# EAGLE design Remote (EAGLE 7.3.0)
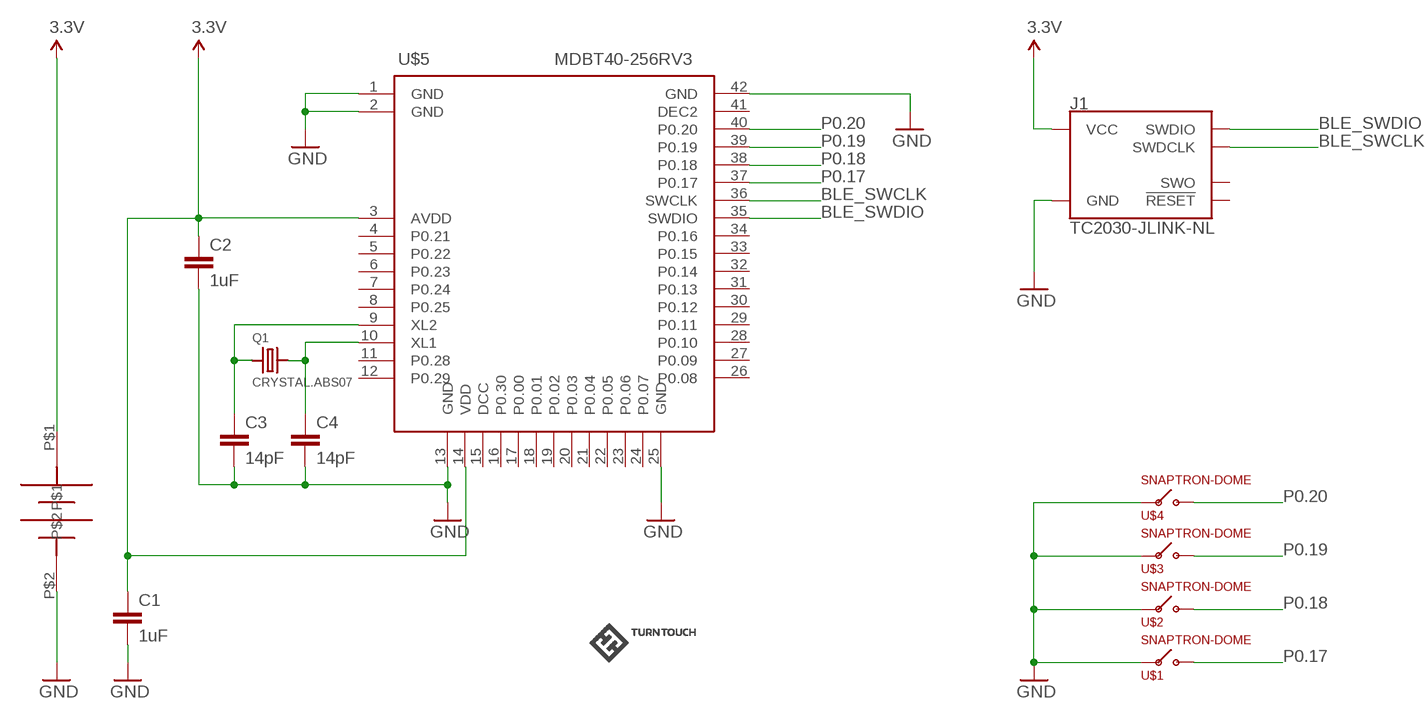
[diagram p0: schematic, sheet 1]

## Parts
C1  1uF  0.1UF-25V(+80/-20%)(0603)  [0603-CAP]
C2  1uF  0.1UF-25V(+80/-20%)(0603)  [0603-CAP]
C3  14pF  0.1UF-25V(+80/-20%)(0603)  [0603-CAP]
C4  14pF  0.1UF-25V(+80/-20%)(0603)  [0603-CAP]
J1  TC2030-JLINK-NL  [TC2030-IDC-NL]
LOGO  TURNTOUCHLOGO200DPI  [LOGO]
Q1  CRYSTAL.ABS07  [ABS07]
U$1  SNAPTRON-DOME  [DOME-M-SERIES]
U$2  SNAPTRON-DOME  [DOME-M-SERIES]
U$3  SNAPTRON-DOME  [DOME-M-SERIES]
U$4  SNAPTRON-DOME  [DOME-M-SERIES]
U$5  MDBT40-256RV3  MDBT40SMD  [MDBT40]
U$6  COINCELLHOLDER  [20MMCOINCELL]

## Nets
3.3V [power]: C1.1 C2.1 J1.1(VCC) U$5.3(AVDD) U$5.14(VDD) U$6.P$1
BLE_SWCLK: J1.4(SWDCLK) U$5.36(SWCLK)
BLE_SWDIO: J1.2(SWDIO) U$5.35(SWDIO)
C5: C4.1 Q1.2 U$5.10(XL1)
GND: C1.2 C2.2 C3.2 C4.2 J1.5(GND) U$1.P$1(V) U$1.P$2(V) U$2.P$1(V) U$2.P$2(V) U$3.P$1(V) U$3.P$2(V) U$4.P$1(V) U$4.P$2(V) U$5.1(GND) U$5.2(GND) U$5.13(GND) U$5.25(GND) U$5.42(GND) U$6.P$2
N$13: C3.1 Q1.1 U$5.9(XL2)
P0.17: U$1.P$3(B) U$5.37(P0.17)
P0.18: U$2.P$3(B) U$5.38(P0.18)
P0.19: U$3.P$3(B) U$5.39(P0.19)
P0.20: U$4.P$3(B) U$5.40(P0.20)
Unconnected: J1.3(!RESET) J1.6(SWO) U$5.4(P0.21) U$5.5(P0.22) U$5.6(P0.23) U$5.7(P0.24) U$5.8(P0.25) U$5.11(P0.28) U$5.12(P0.29) U$5.15(DCC) U$5.16(P0.30) U$5.17(P0.00) U$5.18(P0.01) U$5.19(P0.02) U$5.20(P0.03) U$5.21(P0.04) U$5.22(P0.05) U$5.23(P0.06) U$5.24(P0.07) U$5.26(P0.08) U$5.27(P0.09) U$5.28(P0.10) U$5.29(P0.11) U$5.30(P0.12) U$5.31(P0.13) U$5.32(P0.14) U$5.33(P0.15) U$5.34(P0.16) U$5.41(DEC2)

## Library data of the parts
C1-C4 = SparkFun-Capacitors:0.1UF-25V(+80/-20%)(0603): CAP-00810 Ceramic Standard decoupling cap; PROD_ID: CAP-00810; VALUE: 0.1uF
J1 = connector:TC2030-JLINK
LOGO = remote:TURNTOUCHLOGO
Q1 = abracon:CRYSTAL
U$1-U$4 = remote:SNAPTRON-DOME
U$5 = MDBT40:MDBT40
U$6 = remote:COINCELLHOLDER

## Net classes
0 default: width 0.102 mm, drill 0.203 mm, clearance 0.102 mm
1 power: width 0.254 mm, drill 0.33 mm, clearance 0.152 mm

## Board
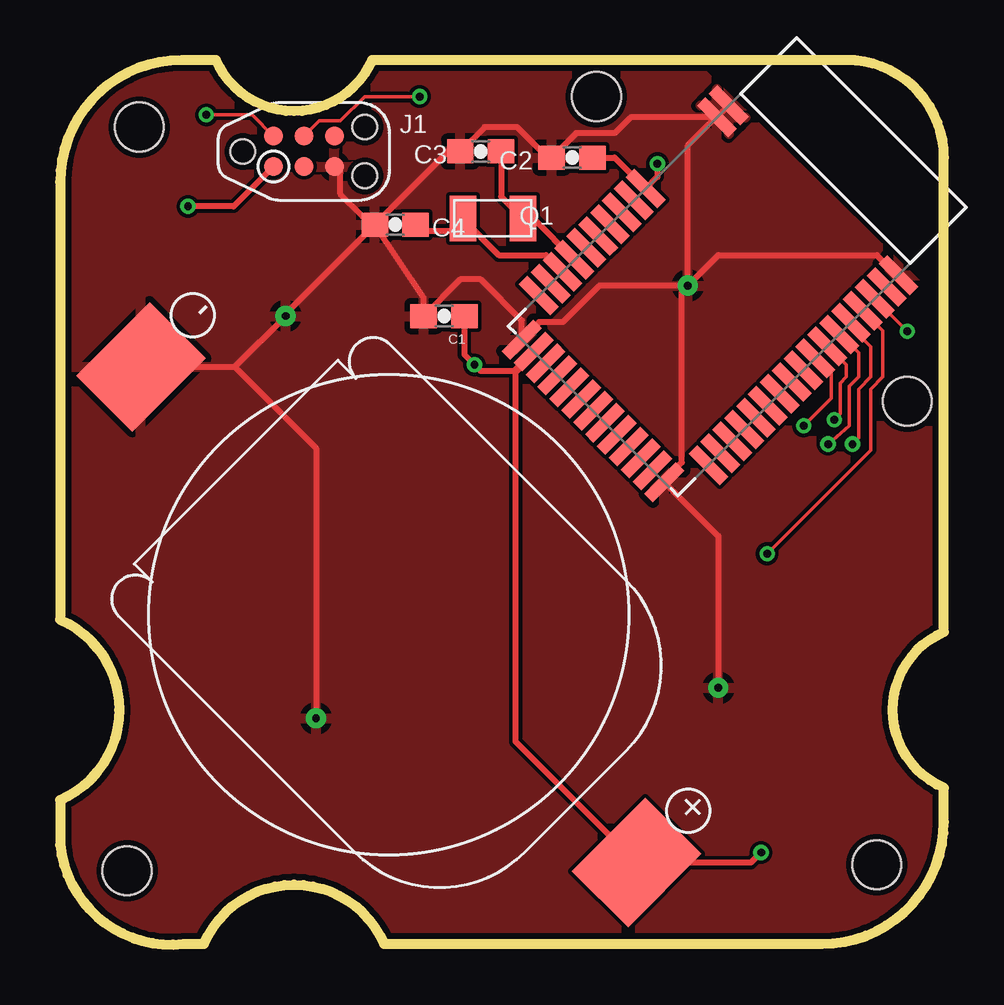
[diagram p1: board, top side]
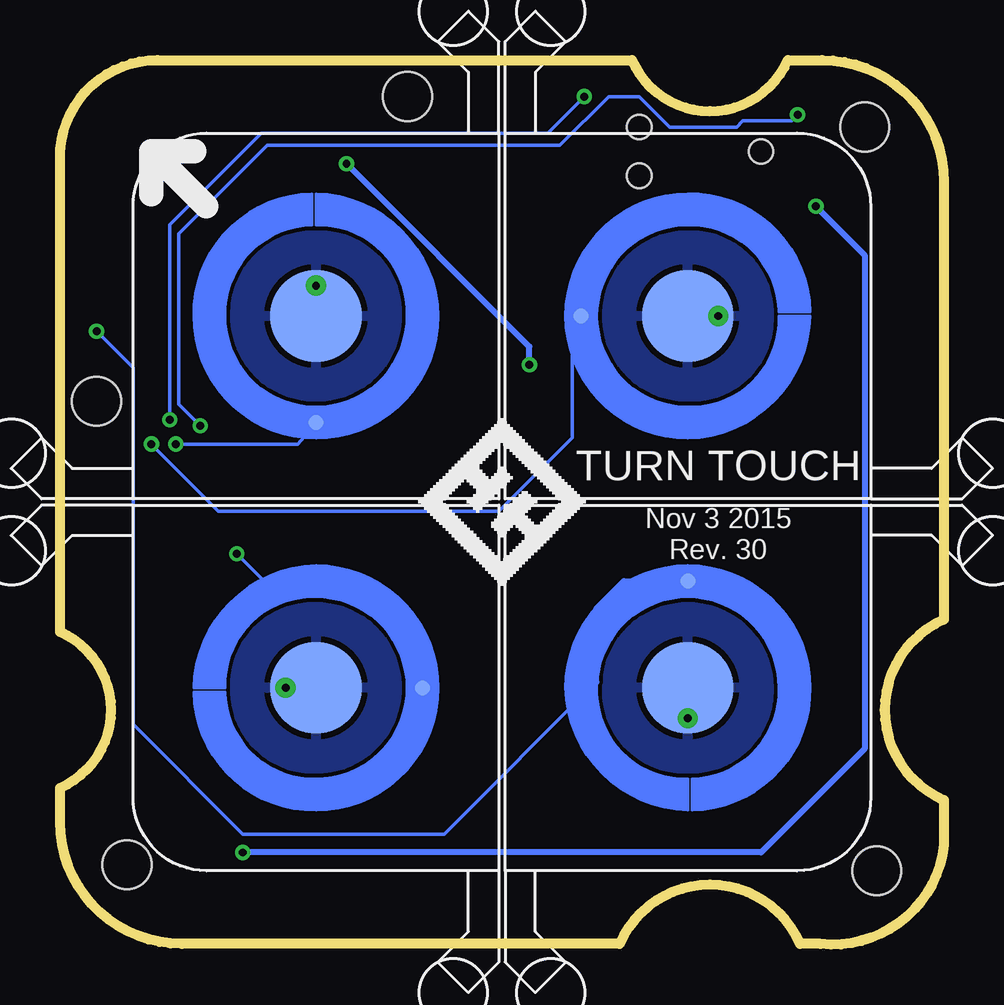
[diagram p2: board, bottom side, seen from below]

Size 36.83 x 36.86 mm. Coordinates in mm from the lower left corner, seen from the top.
Outline: 0,31.78 0,13.54 arc-133 0,6.02 0,4.15 arc90 5.14,0.03 5.99,0.03 arc-133 13.51,0.03 31.75,0.03 arc90 36.83,5.11 36.83,6.53 arc-133 36.83,13.03 36.83,32.79 arc90 32.77,36.86 13,36.86 arc-133 6.5,36.86 5.08,36.86 arc90 0,31.78
Copper layers (1*16): Top 0.035mm / dielectric 1.5mm / Bottom 0.035mm
Design rules "SeeedStudio_2layer_DRU_no_angle_20140221": minimum track width 6mil, minimum drill 12mil, track to track 6mil, track to pad 6mil, pad to pad 6mil, via to via 6mil, smd to smd 0mil, copper to edge 10mil, drill to drill 10mil, minimum pad ring 10mil, minimum via ring 6mil, stop-mask expansion 2mil, vias tented up to drill 100mil, thermal gap 10mil
Holes 2.03 mm at 3.3,34.06 34.04,3.33 22.35,35.33 2.79,3.08 35.31,22.63

### Footprints (pad centres in the part's own frame; a part is rotated, then mirrored left to right if it is on the bottom)
0603-CAP = smd 1.1 x 1: 1 -0.85,0; 2 0.85,0
TC2030-IDC-NL = smd 0.787 x 0.787: 1 -1.27,-0.635; 2 -1.27,0.635; 3 0,-0.635; 4 0,0.635; 5 1.27,-0.635; 6 1.27,0.635 | hole 1.016: -2.54,0; 2.54,1.016; 2.54,-1.016
ABS07 = smd 1.1 x 1.9: 1 -1.25,0; 2 1.25,0
DOME-M-SERIES = smd 3.81 x 3.81: P$1 0,0 | drill 0.33 pad 0.508: P$2 0,1.27 | smd 0.635 x 0.635: P$3 0,-4.445
MDBT40 = smd 1.85 x 0.5: 1 -5,4; 2 -5,3.3; 3 -5,-0.9; 4 -5,-1.6; 5 -5,-2.3; 6 -5,-3; 7 -5,-3.7; 8 -5,-4.4; 9 -5,-5.1; 10 -5,-5.8; 11 -5,-6.5; 12 -5,-7.2; 26 5,-7.2; 27 5,-6.5; 28 5,-5.8; 29 5,-5.1; 30 5,-4.4; 31 5,-3.7; 32 5,-3; 33 5,-2.3; 34 5,-1.6; 35 5,-0.9; 36 5,-0.2; 37 5,0.5; 38 5,1.2; 39 5,1.9; 40 5,2.6; 41 5,3.3; 42 5,4 | smd 0.5 x 1.85: 13 -4.2,-9; 14 -3.5,-9; 15 -2.8,-9; 16 -2.1,-9; 17 -1.4,-9; 18 -0.7,-9; 19 0,-9; 20 0.7,-9; 21 1.4,-9; 22 2.1,-9; 23 2.8,-9; 24 3.5,-9; 25 4.2,-9
20MMCOINCELL = smd 4.318 x 3.302: P$1 0,14.605; P$2 0,-14.605

### Placement (x,y rotation side)
C1  16,26.19 180 top
C2  21.34,32.79 180 top
C3  17.53,33.05 180 top
C4  13.97,30 180 top
J1  10.16,33.05 0 top
LOGO  21.84,15.01 0 bottom
Q1  18.03,30.25 180 top
U$1  26.16,26.19 0 bottom
U$2  10.67,26.19 270 bottom
U$3  26.16,10.7 90 bottom
U$4  10.67,10.7 180 bottom
U$5  MDBT40SMD  [MDBT40]  28.57,28.6 315 top
U$6  13.7,13.74 225 top

### Tracks (layer width: path | path; a pad name or v marks a point on that pad's centre or on a via)
3.3V  (via drill 0.33)
  Top 0.254: C2.1 23.11,32.79 U$5.3 24.89,31.99 v24.89,32.54 | C1.1 16.85,24.58 v17.27,24.16 17.53,23.9 18.93,23.9 | 18.93,23.9 18.99,23.97 | 18.99,23.97 U$5.14 19.74,24.59 19.05,23.9 18.93,23.9 | 18.99,23.97 18.99,8.46 U$6.P$1 28.79,3.42 v29.21,3.84 | J1.1 7.24,30.76 v5.33,30.76
  Bottom 0.254: v5.33,30.76 3.3,28.73 3.3,8.16 7.62,3.84 v29.21,3.84 | v17.27,24.16 17.27,24.92 v24.89,32.54
BLE_SWCLK  (via drill 0.33)
  Top 0.152: J1.4 10.79,34.32 11.68,34.32 12.7,35.33 v14.99,35.33 | v32.26,21.87 32.51,22.13 32.51,23.4 32.77,23.65 32.77,24.16 32,24.93 U$5.36
  Bottom 0.152: v14.99,35.33 16.51,33.81 28.45,33.81 32.26,30 v32.26,21.87
BLE_SWDIO  (via drill 0.33)
  Top 0.152: J1.2 8,34.57 v6.1,34.57 | v30.99,21.62 32.13,22.76 32.13,23.78 U$5.35
  Bottom 0.152: v6.1,34.57 6.35,34.32 8.38,34.32 8.64,34.06 11.43,34.06 12.7,35.33 13.97,35.33 16,33.3 28.19,33.3 31.88,29.62 31.88,22.51 v30.99,21.62
C5
  Top 0.254: C4.1 14.57,29.75 16.28,29.75 Q1.2 16.78,30.23 18.29,28.73 20.25,28.73 U$5.10
GND
  Top 0.254: U$6.P$2 7.28,24.07 | 7.28,24.07 U$2.P$2 9.4,26.28 C4.2 | C4.2 12.61,30.34 11.68,31.27 11.68,32.16 J1.5 | C4.2 15.15,26.95 C1.2 16.68,27.71 17.53,27.71 19.24,26 U$5.13 19.97,25.94 20.95,25.94 22.48,27.46 U$1.P$2 | C4.2 16.42,33.3 C3.2 17.69,34.06 19.05,34.06 20.32,32.79 C2.2 21.5,33.81 23.11,33.81 23.78,34.47 U$5.2 | U$1.P$2 25.91,27.21 25.91,20.09 25.18,19.37 U$5.25 27.43,17.02 U$3.P$2 | U$1.P$2 26.16,33.3 27.43,34.57 27.47,34.57 U$5.1 | U$1.P$2 27.43,28.73 34.04,28.73 34.87,27.9 U$5.42 | 7.28,24.07 10.67,20.68 U$4.P$2
  Bottom 0.254: U$2.P$1 U$2.P$2 | U$4.P$1 U$4.P$2 | U$3.P$1 U$3.P$2 | U$1.P$1 U$1.P$2
  pour Bottom: -1.02,-0.73 37.59,-0.73 37.59,25.43 24.89,37.87 -1.02,37.87
  pour Top: -1.78,38.64 24.38,38.64 38.1,25.17 38.35,-1.5 -1.78,-1.5
N$13
  Top 0.254: U$5.9 19.71,30.25 Q1.1 18.38,31.16 C3.1
P0.17  (via drill 0.33)
  Top 0.152: v32,20.86 32.89,21.62 32.89,23.27 33.27,23.65 33.27,24.67 32.52,25.42 U$5.37
  Bottom 0.152: v32,20.86 26.92,20.86 U$1.P$3
P0.18  (via drill 0.33)
  Top 0.152: v33.02,20.86 33.27,21.11 33.27,23.14 33.78,23.65 33.78,24.92 32.96,25.74 U$5.38
  Bottom 0.152: U$2.P$3 15.49,25.81 15.49,21.11 18.54,18.06 30.23,18.06 v33.02,20.86
P0.19  (via drill 0.33)
  Top 0.152: U$5.39 34.29,25.57 34.29,23.65 33.78,23.14 33.78,20.6 v29.46,16.28
  Bottom 0.152: v29.46,16.28 28.19,15.01
  Bottom 0.254: 28.19,15.01 24.89,15.01 21.72,11.84 U$3.P$3
P0.20  (via drill 0.33)
  Top 0.152: 34.54,26.31 v35.31,25.55
  Top 0.254: U$5.40 34.54,26.31
  Bottom 0.152: v35.31,25.55 33.78,24.03 33.78,9.17 29.21,4.6 20.83,4.6 14.48,10.95
  Bottom 0.254: 14.48,10.95 14.48,14 13.34,15.14 U$4.P$3

### Text on the board
bNames: TURN TOUCH | Nov 3 2015 / Rev. 30